# Altium project QAM16.PrjPcb (part 1 of 3)
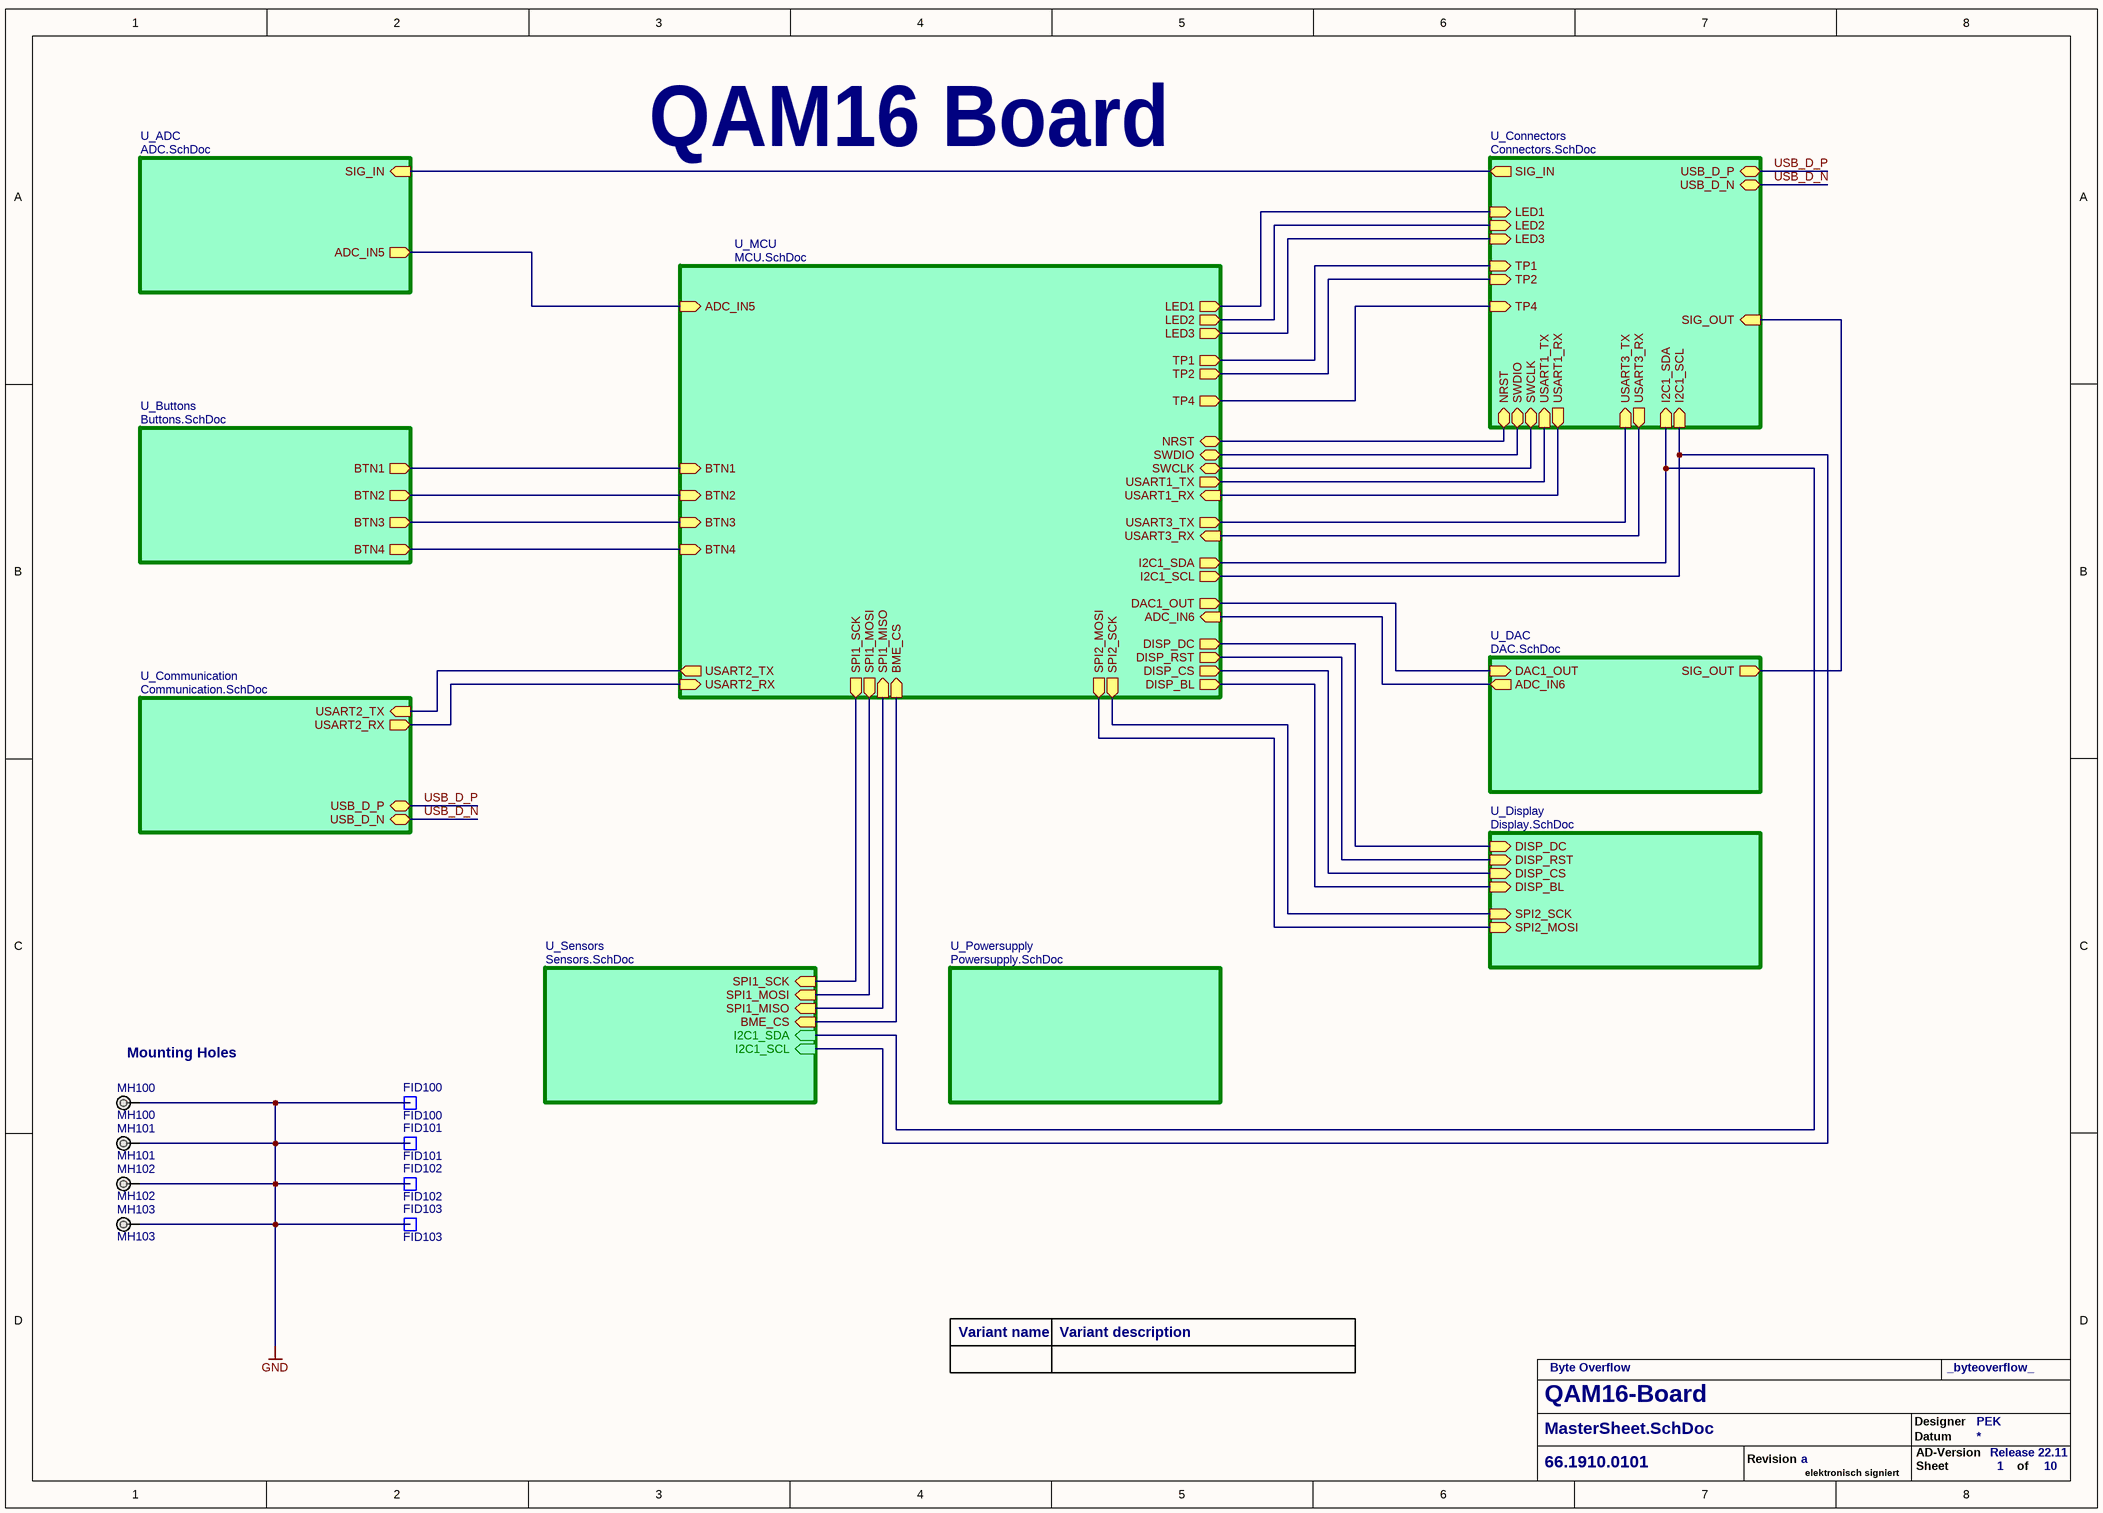
[diagram p0: MasterSheet.SchDoc]
Altium_Version: Release 22.11; PCB_Controll: electronic; PCB_Copper_Thickness: 35um; PCB_Data: Gerber; PCB_Designer: PEK; PCB_Layer_Count: 4; PCB_Material: FR-4 / UL94V-0; PCB_Nummer: 66.1910.0101; PCB_Silkscreen: Top; PCB_Solder_Surface: chem.NiAu - partial; PCB_Surface: black; PCB_Thickness: 1.60 mm; Project_Name: QAM16-Board; Revision_V: a; Schematic_Designer: PEK; Stencil_Thickness: 0.125mm
10 sheets, 209 parts. Net scope: hierarchical (ports join the sheet entries above them; power ports are global).
Board file: QAM16_PCB.PcbDoc
Sheets:
  MasterSheet.SchDoc
    U_ADC = ADC.SchDoc
    U_Buttons = Buttons.SchDoc
    U_Communication = Communication.SchDoc
    U_Connectors = Connectors.SchDoc
    U_DAC = DAC.SchDoc
    U_Display = Display.SchDoc
    U_Sensors = Sensors.SchDoc
    U_MCU = MCU.SchDoc
    U_Powersupply = Powersupply.SchDoc

## Sheet MasterSheet.SchDoc
size A3; Organization: Rotronic AG; Address1: Grindelstrasse 6; Address2: 8303 Bassersdorf; Address3: Switzerland; DocumentNumber: 1; SheetNumber: 1; SheetTotal: 10; Web_Address: www.rotronic.ch; E_Mail_Address: *@rotronic.ch; Fon: +41 (0)44 838 11 11; Fax: +41 (0)44 836 44 24

### Parts
FID100  FID100  [FIDUCIAL_2]
FID101  FID101  [FIDUCIAL_2]
FID102  FID102  [FIDUCIAL_2]
FID103  FID103  [FIDUCIAL_2]
MH100  MH100  [MH_M3_RND_2]  (no BOM)
MH101  MH101  [MH_M3_RND_2]  (no BOM)
MH102  MH102  [MH_M3_RND_2]  (no BOM)
MH103  MH103  [MH_M3_RND_2]  (no BOM)

### Sub-sheets
U_ADC = ADC.SchDoc: ADC_IN5 (out), SIG_IN (in)
U_Buttons = Buttons.SchDoc: BTN1 (out), BTN2 (out), BTN3 (out), BTN4 (out)
U_Communication = Communication.SchDoc: USB_D_N (bidir), USB_D_P (bidir), USART2_RX (out), USART2_TX (in)
U_Connectors = Connectors.SchDoc: NRST (bidir), USB_D_N (bidir), USB_D_P (bidir), USART1_RX (out), USART1_TX (in), SWCLK (bidir), SWDIO (bidir), LED1 (in), LED2 (in), LED3 (in), USART3_RX (out), USART3_TX (in), I2C1_SDA (in), I2C1_SCL (in), SIG_IN (out), SIG_OUT (in), TP4 (in), TP2 (in), TP1 (in)
U_DAC = DAC.SchDoc: DAC1_OUT (in), SIG_OUT (out), ADC_IN6 (out)
U_Display = Display.SchDoc: DISP_DC (in), DISP_RST (in), DISP_CS (in), SPI2_SCK (in), SPI2_MOSI (in), DISP_BL (in)
U_MCU = MCU.SchDoc: SWCLK (bidir), SWDIO (bidir), NRST (bidir), SPI1_SCK (out), SPI1_MOSI (out), SPI1_MISO (in), USART1_RX (in), BTN2 (in), BTN1 (in), USART3_RX (in), USART3_TX (out), TP2 (out), TP1 (out), BME_CS (in), USART2_RX (in), ADC_IN6 (in), ADC_IN5 (in), BTN4 (in), BTN3 (in), USART2_TX (out), DAC1_OUT (out), DISP_DC (out), DISP_RST (out), DISP_CS (out), DISP_BL (out), SPI2_SCK (out), SPI2_MOSI (out), I2C1_SDA (out), I2C1_SCL (out), USART1_TX (out), TP4 (out), LED1 (out), LED2 (out), LED3 (out)
U_Powersupply = Powersupply.SchDoc: no entries
U_Sensors = Sensors.SchDoc: SPI1_SCK (in), SPI1_MOSI (in), SPI1_MISO (in), BME_CS (in), I2C1_SDA (in), I2C1_SCL (in)

### Nets
GND: FID100.1 FID101.1 FID102.1 FID103.1 MH100.1 MH101.1 MH102.1 MH103.1
ADC_IN5: sheet U_ADC/ADC_IN5, sheet U_MCU/ADC_IN5
ADC_IN6: sheet U_DAC/ADC_IN6, sheet U_MCU/ADC_IN6
BME_CS: sheet U_Sensors/BME_CS, sheet U_MCU/BME_CS
BTN1: sheet U_Buttons/BTN1, sheet U_MCU/BTN1
BTN2: sheet U_Buttons/BTN2, sheet U_MCU/BTN2
BTN3: sheet U_Buttons/BTN3, sheet U_MCU/BTN3
BTN4: sheet U_Buttons/BTN4, sheet U_MCU/BTN4
DAC1_OUT: sheet U_DAC/DAC1_OUT, sheet U_MCU/DAC1_OUT
DISP_BL: sheet U_Display/DISP_BL, sheet U_MCU/DISP_BL
DISP_CS: sheet U_Display/DISP_CS, sheet U_MCU/DISP_CS
DISP_DC: sheet U_Display/DISP_DC, sheet U_MCU/DISP_DC
DISP_RST: sheet U_Display/DISP_RST, sheet U_MCU/DISP_RST
I2C1_SCL: sheet U_Connectors/I2C1_SCL, sheet U_Sensors/I2C1_SCL, sheet U_MCU/I2C1_SCL
I2C1_SDA: sheet U_Connectors/I2C1_SDA, sheet U_Sensors/I2C1_SDA, sheet U_MCU/I2C1_SDA
LED1: sheet U_Connectors/LED1, sheet U_MCU/LED1
LED2: sheet U_Connectors/LED2, sheet U_MCU/LED2
LED3: sheet U_Connectors/LED3, sheet U_MCU/LED3
NRST: sheet U_Connectors/NRST, sheet U_MCU/NRST
SIG_IN: sheet U_ADC/SIG_IN, sheet U_Connectors/SIG_IN
SIG_OUT: sheet U_Connectors/SIG_OUT, sheet U_DAC/SIG_OUT
SPI1_MISO: sheet U_Sensors/SPI1_MISO, sheet U_MCU/SPI1_MISO
SPI1_MOSI: sheet U_Sensors/SPI1_MOSI, sheet U_MCU/SPI1_MOSI
SPI1_SCK: sheet U_Sensors/SPI1_SCK, sheet U_MCU/SPI1_SCK
SPI2_MOSI: sheet U_Display/SPI2_MOSI, sheet U_MCU/SPI2_MOSI
SPI2_SCK: sheet U_Display/SPI2_SCK, sheet U_MCU/SPI2_SCK
SWCLK: sheet U_Connectors/SWCLK, sheet U_MCU/SWCLK
SWDIO: sheet U_Connectors/SWDIO, sheet U_MCU/SWDIO
TP1: sheet U_Connectors/TP1, sheet U_MCU/TP1
TP2: sheet U_Connectors/TP2, sheet U_MCU/TP2
TP4: sheet U_Connectors/TP4, sheet U_MCU/TP4
USART1_RX: sheet U_Connectors/USART1_RX, sheet U_MCU/USART1_RX
USART1_TX: sheet U_Connectors/USART1_TX, sheet U_MCU/USART1_TX
USART2_RX: sheet U_Communication/USART2_RX, sheet U_MCU/USART2_RX
USART2_TX: sheet U_Communication/USART2_TX, sheet U_MCU/USART2_TX
USART3_RX: sheet U_Connectors/USART3_RX, sheet U_MCU/USART3_RX
USART3_TX: sheet U_Connectors/USART3_TX, sheet U_MCU/USART3_TX
USB_D_N: sheet U_Communication/USB_D_N, sheet U_Connectors/USB_D_N
USB_D_P: sheet U_Communication/USB_D_P, sheet U_Connectors/USB_D_P

### Notes on the sheet
- QAM16 Board
- (near MH100) Mounting Holes
- Variant name
- Variant description
- Byte Overflow
- _byteoverflow_
- Revision
- Designer
- Datum
- AD-Version
- elektronisch signiert
- Sheet
- of

### Library data of the parts
FID100-FID103 = C0039: FIDUCIAL; Part-Number: 00.0000.0000; Designator: FIDUCIAL-2; ID: C0039; Operating Range: -50°C to +130°C; Specification: 19.09.2011 MLP; Value: FIDUCIAL-2; Component Type: Standard; Status: Active; Availability Date: -; RoHS compliant: Yes; Flammability: UL 94 V-0; Note: FIDUCIAL-2; Price Date: 07.10.2011 MLP; Price 100: 0; Price 1000: 0; Pin Count: 1; Changed: 19.09.2011 MLP; Price: 0
MH100-MH103 = C0025: PCB hole; Part-Number: 00.0000.0000; ID: C0025; Operating Range: -50°C to +130°C; Specification: 15.01.2013 OPT; Value: MH_M3_RND_2; Designator: MH_M3_RND_2; Component Type: Standard; Status: Active; Availability Date: -; Note: MH_M3_RND_2; Price Date: 15.01.2013 OPT; Price 100: 0; Price 1000: 0; Pin Count: 1; Changed: 15.01.2013 OPT; Price: 0.000

## Sheet ADC.SchDoc
size A4; Organization: Rotronic AG; Address1: Grindelstrasse 6; Address2: 8303 Bassersdorf; Address3: Switzerland; DocumentNumber: 9; SheetNumber: 9; SheetTotal: 10; Web_Address: www.rotronic.ch; E_Mail_Address: *@rotronic.ch; Fon: +41 (0)44 838 11 11; Fax: +41 (0)44 836 44 24
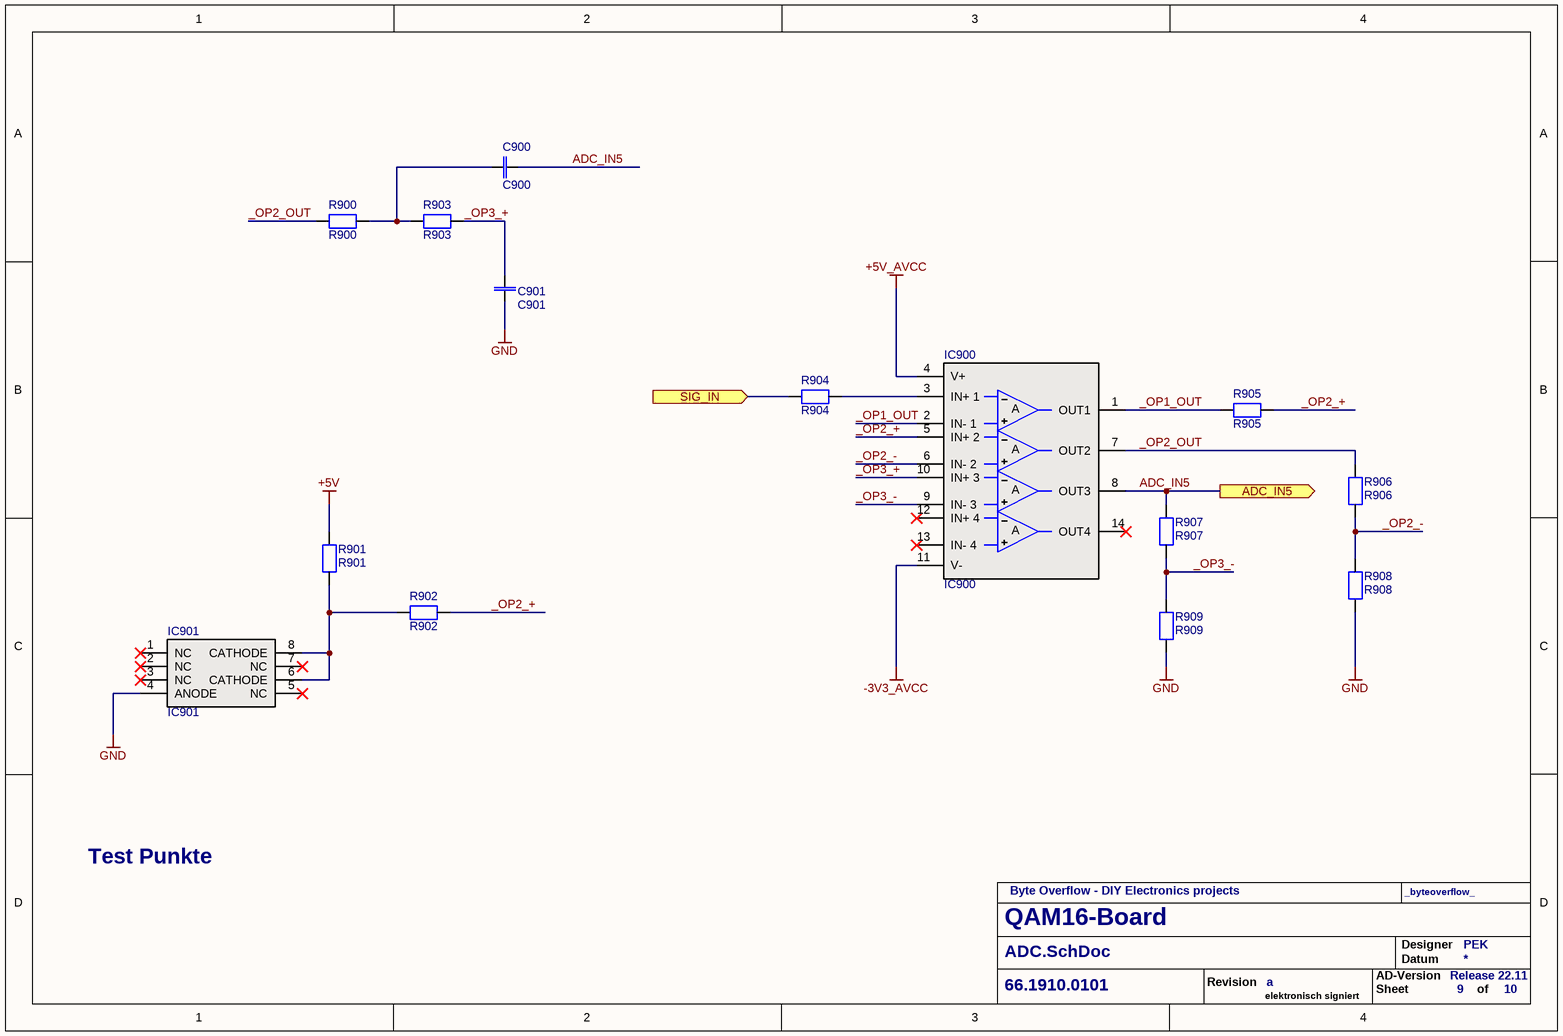
[diagram p1: ADC.SchDoc]

### Parts
C900  C900  [0603-1608]
C901  C901  [0603-1608]
IC900  IC900  [SOIC-14]
IC901  IC901  [MO-153AA]
R900  R900  [0603-1608]
R901  R901  [0805-2012]
R902  R902  [0603-1608]
R903  R903  [0603-1608]
R904  R904  [0603-1608]
R905  R905  [0603-1608]
R906  R906  [0603-1608]
R907  R907  [0603-1608]
R908  R908  [0603-1608]
R909  R909  [0603-1608]

### Ports
ADC_IN5 (out), SIG_IN (in)

### Nets
+5V: R901.1
+5V_AVCC: IC900.4(V+)
-3V3_AVCC: IC900.11(V-)
GND: C901.1 IC901.4(ANODE) R908.1 R909.1
_OP1_OUT: IC900.1(OUT1) IC900.2(IN-_1) R905.1
_OP2_+: IC900.5(IN+_2) R902.2 R905.2
_OP2_-: IC900.6(IN-_2) R906.2 R908.2
_OP2_OUT: IC900.7(OUT2) R900.1 R906.1
_OP3_+: C901.2 IC900.10(IN+_3) R903.2
_OP3_-: IC900.9(IN-_3) R907.2 R909.2
ADC_IN5: C900.2 IC900.8(OUT3) R907.1 ; port ADC_IN5
SIG_IN: R904.1 ; port SIG_IN
NetC900_1: C900.1 R900.2 R903.1
NetIC900_3: IC900.3(IN+_1) R904.2
NetIC901_6: IC901.6(CATHODE) IC901.8(CATHODE) R901.2 R902.1

Not connected (* = marked no-connect by the designer): IC900 12(IN+_4)* 13(IN-_4)* 14(OUT4)*; IC901 1(NC)* 2(NC)* 3(NC)* 5(NC)* 7(NC)*

### Notes on the sheet
- Test Punkte
- Byte Overflow - DIY Electronics projects
- _byteoverflow_
- Revision
- AD-Version
- Designer
- Datum
- elektronisch signiert
- Sheet
- of
- (in symbol I0016) A

### Library data of the parts
C900 C901 = F0058: Capacitor; Part-Number: 63.0224.1400; Manufacturer: KEMET; Manufacturer Part Number: C0603C224K4RAC7867; Designator: C 220nF 16V; ID: F0058; Operating Range: -55°C to +85°C; Note: 220nF X5R 16V 10% Taiyo Yuden EMK107BJ224KAHT; Specification: 19.09.2011 MLP; Verification: 05.07.2012 OPT; Value: 220nF 16V; Component Type: Standard; ComponentLink1Description: http://www.kemet.com/docfinder?Partnumber=C0603C224K4RACTU; ComponentLink1URL: http://www.kemet.com/docfinder?Partnumber=C0603C224K4RACTU; Status: Active; Availability Date: 15.11.2016 OPT; RoHS compliant: Yes; Flammability: n.a.; Pin Count: 2; Price 100: 0.02; Price 1000: 0.02; Price Date: 02.12.2019 Pro Alpha; Changed: 19.09.2011 MLP; Price: 0.02; Supplier 1: Digi-Key; Supplier Part Number 1: 399-5619-1-ND; Part Status: Active; RoHS: RoHS Compliant
IC900 = I0016: OPAMP; Part-Number: 00.0000.0000; Manufacturer: Texas Instruments; Designator: LMC6484IMX/NOPB; ID: I0016; Operating Range: -40°C to +125°C; Note: Operationsverstärker CMOS QUAD Rail to Rail; Changed: 19.09.2020 PEK; Value: LMC6484IMX/NOPB; Component Type: Standard; ComponentLink1Description: Datasheet; ComponentLink1URL: https://www.ti.com/lit/ds/symlink/lmc6484.pdf?ts=1600470487572&ref_url=https%253A%252F%252Fwww.ti.com%252Fstore%252Fti%252Fen%252Fp%252Fproduct%252F%253Fp%253DLMC6484IMX%252FNOPB; Status: Active; Availability Date: 19.09.2020 PEK; RoHS compliant: Yes; Flammability: n.a.; Pin Count: 14; Price 100: 1.52; Price 1000: 1.03; Price Date: 19.09.2020 PEK; Specification: 19.09.2020 PEK; Price: 2.25; Supplier 1: Mouser; Supplier Part Number 1: LMC6484IMX/NOPB; Manufacturer Part Number: LMC6484IMX/NOPB; Part Status: Active; RoHS: RoHS Compliant
IC901 = E0101: Voltage reference; Part-Number: 00.0000.0000; Manufacturer: Texas Instruments; Designator: LT1004IPWR-1-2; ID: E0101; Operating Range: -55°C to +85°C; Note: Ti LT1004IPWR-1-2 1.235V MICROPOWER INTEGRATED VOLTAGE REFERENCE; Specification: 28.10.2015 OPT; Value: LT1004IPWR-1-2; Component Type: Standard; ComponentLink1Description: Datasheet; ComponentLink1URL: http://www.ti.com/lit/ds/symlink/lt1004-1.2.pdf; Status: Active; Availability Date: 15.11.2016 OPT; RoHS compliant: Yes; Flammability: n.a.; Pin Count: 8; Price 100: 0.587; Price 1000: 0.409; Price Date: 28.10.2015 OPT; Changed: 28.10.2015 OPT; Price: 0.946; Supplier 1: Digi-Key; Supplier Part Number 1: 296-13079-1-ND; Manufacturer Part Number: LT1004IPWR-1-2; Part Status: Active; RoHS: RoHS Compliant
R900 R902-R905 R908 R909 = Q0017: Resistor; Part-Number: 71.1002.1300; Manufacturer: Vishay Dale; Manufacturer Part Number: CRCW060310K0FKEAHP; Designator: R 10k 1%; ID: Q0017; Operating Range: -55°C to +155°C; Note: 10k 1% 100ppm 1/10W Vishay CRCW060310K0FKEA; Changed: 19.09.2011 MLP; Verification: 05.07.2012 OPT; Value: 10k; Component Type: Standard; ComponentLink1Description: http://www.vishay.com/docs/20043/crcwhpe3.pdf; ComponentLink1URL: http://www.vishay.com/docs/20043/crcwhpe3.pdf; Status: Active; Availability Date: 16.11.2016 OPT; RoHS compliant: Yes; Flammability: n.a.; Pin Count: 2; Price 100: 0.002; Price 1000: 0.002; Price Date: 02.12.2019 Pro Alpha; Specification: 19.09.2011 MLP; Price: 0.001; Supplier: Digi-Key; Supplier Part Number: 541-10.0KSCT-ND; Part Status: Active; RoHS: RoHS Compliant
R901 = Q0328: Resistor; Part-Number: 71.1003.1700; Manufacturer: Vishay Dale; Manufacturer Part Number: CRCW0805100KFKEA; Designator: R 100k 1.0%; ID: Q0328; Operating Range: -55°C to +155°C; Note: 100k 1.0% 100ppm 1/8W Vishay CRCW0805100KFKEA; Changed: 28.07.2015 OPT; Value: 100k 1.0%; Component Type: Standard; ComponentLink1Description: Datasheet; ComponentLink1URL: http://www.vishay.com/docs/20035/dcrcwe3.pdf; Status: Active; Availability Date: 16.11.2016 OPT; RoHS compliant: Yes; Flammability: n.a.; Pin Count: 2; Price 100: 0.026; Price 1000: 0.018; Price Date: 02.12.2019 Pro Alpha; Specification: 28.07.2015 OPT; Price: 0.009; Supplier: Digi-Key; Supplier Part Number: 541-100KCCT-ND; Part Status: Active; RoHS: RoHS Compliant
R906 R907 = Q0180: Resistor; Part-Number: 71.6801.1300; Manufacturer: Vishay Dale; Manufacturer Part Number: CRCW06036K80FKEA; Designator: R 6.8k 1%; ID: Q0180; Operating Range: -55°C to +155°C; Note: 6.8k 1% 100ppm 1/10W Vishay CRCW06036K80FKEA; Changed: 19.09.2011 MLP; Verification: 05.07.2012 OPT; Value: 6.8k 1%; Component Type: Standard; ComponentLink1Description: http://www.vishay.com/docs/20035/dcrcwe3.pdf; ComponentLink1URL: http://www.vishay.com/docs/20035/dcrcwe3.pdf; Status: Active; Availability Date: 16.11.2016 OPT; RoHS compliant: Yes; Flammability: n.a.; Pin Count: 2; Price 100: 0.002; Price 1000: 0.002; Price Date: 02.12.2019 Pro Alpha; Specification: 19.09.2011 MLP; Price: 0.002; Supplier: Digi-Key; Supplier Part Number: 541-6.80KHCT-ND; Part Status: Active; RoHS: RoHS Compliant

## Sheet Buttons.SchDoc
size A4; Organization: Rotronic AG; Address1: Grindelstrasse 6; Address2: 8303 Bassersdorf; Address3: Switzerland; DocumentNumber: 3; SheetNumber: 3; SheetTotal: 10; Web_Address: www.rotronic.ch; E_Mail_Address: *@rotronic.ch; Fon: +41 (0)44 838 11 11; Fax: +41 (0)44 836 44 24
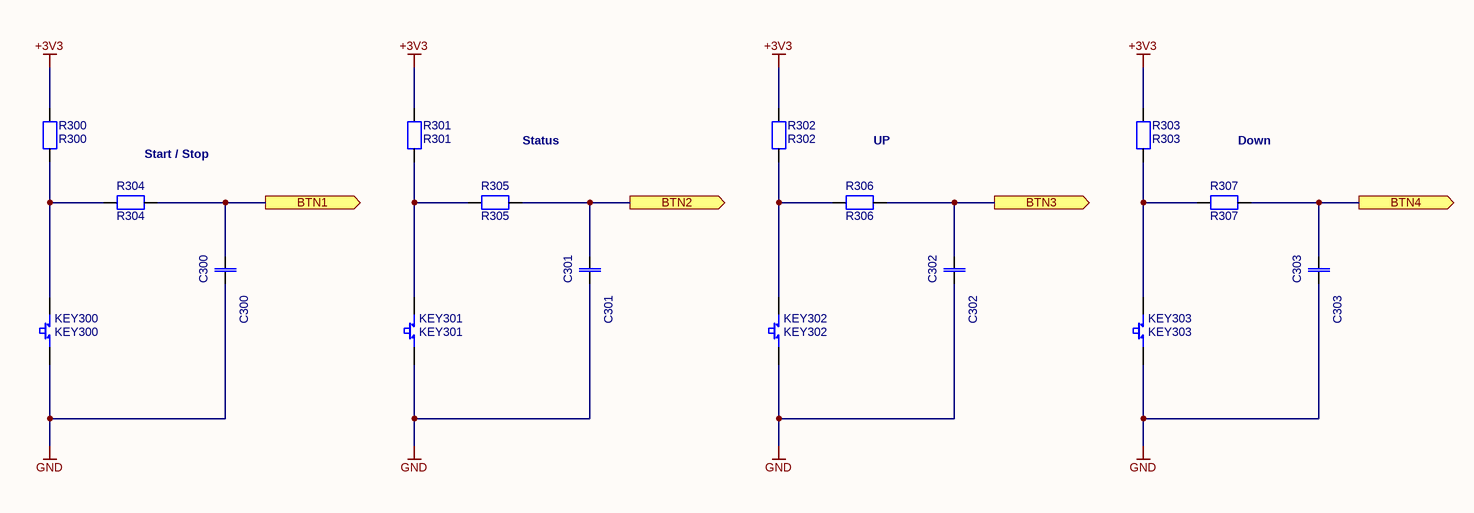
[diagram p2: Buttons.SchDoc]

### Parts
C300  C300  [0603-1608]
C301  C301  [0603-1608]
C302  C302  [0603-1608]
C303  C303  [0603-1608]
KEY300  KEY300  [SW_TL9210AF180Q]
KEY301  KEY301  [SW_TL9210AF180Q]
KEY302  KEY302  [SW_TL9210AF180Q]
KEY303  KEY303  [SW_TL9210AF180Q]
R300  R300  [0603-1608]
R301  R301  [0603-1608]
R302  R302  [0603-1608]
R303  R303  [0603-1608]
R304  R304  [0603-1608]
R305  R305  [0603-1608]
R306  R306  [0603-1608]
R307  R307  [0603-1608]

### Ports
BTN1 (out), BTN2 (out), BTN3 (out), BTN4 (out)

### Nets
+3V3: R300.1 R301.1 R302.1 R303.1
GND: C300.2 C301.2 C302.2 C303.2 KEY300.1 KEY301.1 KEY302.1 KEY303.1
BTN1: C300.1 R304.2 ; port BTN1
BTN2: C301.1 R305.2 ; port BTN2
BTN3: C302.1 R306.2 ; port BTN3
BTN4: C303.1 R307.2 ; port BTN4
NetKEY300_2: KEY300.2 R300.2 R304.1
NetKEY301_2: KEY301.2 R301.2 R305.1
NetKEY302_2: KEY302.2 R302.2 R306.1
NetKEY303_2: KEY303.2 R303.2 R307.1

### Notes on the sheet
- (near R304) Start / Stop
- Status
- UP
- Down
- Byte Overflow - DIY Electronics projects
- mootseeker98@gmail.com
- Revision
- AD-Version
- Designer
- Datum
- elektronisch signiert
- Sheet
- of

### Library data of the parts
C300-C303 = F0161: Capacitor; Part-Number: 63.0104.1450; Manufacturer: KEMET; Manufacturer Part Number: C0603C104K5RACTU; Designator: C 100nF 50V X7R; ID: F0161; Operating Range: -55°C to +125°C; Note: 100nF 50V X7R 10% Kemet C0603C104K5RACTU; Specification: 05.09.2013 OPT; Value: 100nF 50V; Component Type: Standard; ComponentLink1Description: Datasheet; ComponentLink1URL: http://www.kemet.com/kemet/web/homepage/kechome.nsf/vapubfiles/KEM_C1002_X7R_SMD.pdf/$file/KEM_C1002_X7R_SMD.pdf; Status: Active; Availability Date: 15.11.2016 OPT; RoHS compliant: Yes; Flammability: n.a.; Pin Count: 2; Price 100: 0.007; Price 1000: 0.007; Price Date: 02.12.2019 Pro Alpha; Changed: 05.09.2013 OPT; Price: 0.01; Supplier 1: Digi-Key; Supplier Part Number 1: 399-5089-1-ND; Part Status: Active; RoHS: RoHS Compliant
KEY300-KEY303 = O0015: Button; Part-Number: 00.0000.0000; Manufacturer: E-Switch; ID: O0015; Operating Range: -20°C to +60°C; Note: Sensorschalter 180gF SPST LngTravel 50mA 12VDC 200gF; Specification: 05.11.2022 PEK; Value: TL9210AF180Q; Component Type: Standard; ComponentLink1Description: Datasheet; ComponentLink1URL: https://www.mouser.ch/datasheet/2/140/e-switch_TL9210-1165861.pdf; Status: Active; Availability Date: 05.11.2022 PEK; RoHS compliant: Yes; Flammability: n.a.; Pin Count: 2; Price 100: 0.61; Price 1000: 0.38; Price Date: 05.11.2022 PEK; Changed: 05.11.2022 PEK; Price: 0.63; Supplier 1: Mouser; Supplier Part Number 1: 612-TL9210AF180Q; Manufacturer Part Number: TL9210AF180Q; Part Status: Active; RoHS: RoHS Compliant; Designator: TL9210AF180Q
R300-R303 = Q0017: as R900 on sheet ADC; Component Type: Standard; ComponentLink1Description: http://www.vishay.com/docs/20043/crcwhpe3.pdf; ComponentLink1URL: http://www.vishay.com/docs/20043/crcwhpe3.pdf; Status: Active; Availability Date: 16.11.2016 OPT; RoHS compliant: Yes; Flammability: n.a.; Pin Count: 2; Price 100: 0.002; Price 1000: 0.002; Price Date: 02.12.2019 Pro Alpha; Specification: 19.09.2011 MLP; Price: 0.001; Supplier: Digi-Key; Supplier Part Number: 541-10.0KSCT-ND; Part Status: Active; RoHS: RoHS Compliant
R304-R307 = Q0011: Resistor; Part-Number: 71.1000.1300; Manufacturer: Vishay Dale; Manufacturer Part Number: CRCW0603100RFKEA; Designator: R 100E 1%; ID: Q0011; Operating Range: -55°C to +155°C; Note: 100E 1% 100ppm 1/10W Vishay / Dale CRCW0603100RFKTB; Changed: 19.09.2011 MLP; Verification: 05.07.2012 OPT; Value: 100E 1%; Component Type: Standard; ComponentLink1Description: http://www.vishay.com/docs/20035/dcrcwe3.pdf; ComponentLink1URL: http://www.vishay.com/docs/20035/dcrcwe3.pdf; Status: Active; Availability Date: 16.11.2016 OPT; RoHS compliant: Yes; Flammability: n.a.; Pin Count: 2; Price 100: 0.002; Price 1000: 0.002; Price Date: 02.12.2019 Pro Alpha; Specification: 19.09.2011 MLP; Price: 0.002; Supplier: Digi-Key; Supplier Part Number: 541-100HCT-ND; Part Status: Active; RoHS: RoHS Compliant

## Sheet Communication.SchDoc
size A4; Organization: Rotronic AG; Address1: Grindelstrasse 6; Address2: 8303 Bassersdorf; Address3: Switzerland; DocumentNumber: 6; SheetNumber: 6; SheetTotal: 10; Web_Address: www.rotronic.ch; E_Mail_Address: *@rotronic.ch; Fon: +41 (0)44 838 11 11; Fax: +41 (0)44 836 44 24
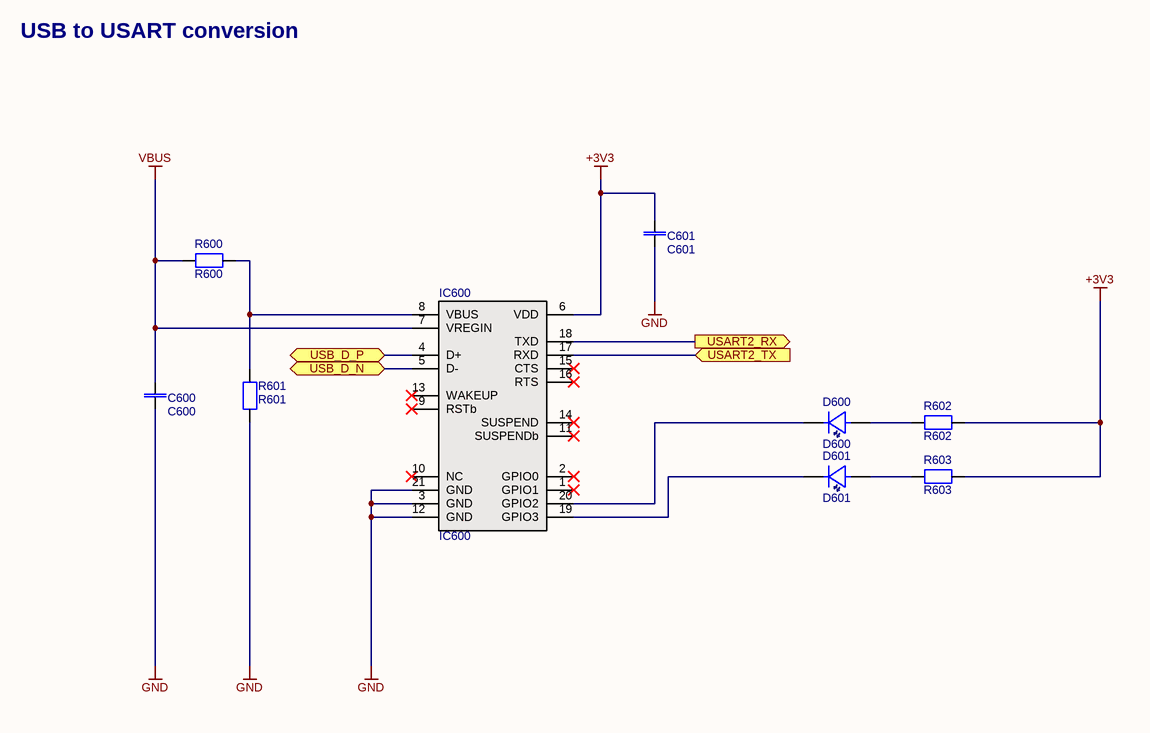
[diagram p3: Communication.SchDoc]

### Parts
C600  C600  [0805-2012]
C601  C601  [0805-2012]
D600  D600  [0805_LED]
D601  D601  [0805_LED]
IC600  IC600  [GQFN20R]
R600  R600  [0603-1608]
R601  R601  [0603-1608]
R602  R602  [0805-2012]
R603  R603  [0805-2012]

### Ports
USART2_RX (out), USART2_TX (in), USB_D_N (bidir), USB_D_P (bidir)

### Nets
+3V3: C601.1 IC600.6(VDD) R602.2 R603.2
GND: C600.2 C601.2 IC600.3(GND) IC600.12(GND) IC600.21(GND) R601.2
VBUS: C600.1 IC600.7(VREGIN) R600.1
USART2_RX: IC600.18(TXD) ; port USART2_RX
USART2_TX: IC600.17(RXD) ; port USART2_TX
USB_D_N: IC600.5(D-) ; port USB_D_N
USB_D_P: IC600.4(D+) ; port USB_D_P
NetD600_1: D600.1(A) R602.1
NetD600_2: D600.2(K) IC600.20(GPIO2)
NetD601_1: D601.1(A) R603.1
NetD601_2: D601.2(K) IC600.19(GPIO3)
NetIC600_8: IC600.8(VBUS) R600.2 R601.1

Not connected (* = marked no-connect by the designer): IC600 1(GPIO1)* 2(GPIO0)* 9(RSTb)* 10(NC)* 11(SUSPENDb)* 13(WAKEUP)* 14(SUSPEND)* 15(CTS)* 16(RTS)*

### Notes on the sheet
- USB to USART conversion
- Byte Overflow - DIY Electronics projects
- _byteoverflow_
- Revision
- AD-Version
- Designer
- Datum
- elektronisch signiert
- Sheet
- of

### Library data of the parts
C600 C601 = F0127: Capacitor; Part-Number: 63.0105.1500; Manufacturer: Murata Electronics North America; Manufacturer Part Number: GRM21BF51H105ZA12L; Designator: C 1uF 50V; ID: F0127; Operating Range: -30°C to +85°C; Note: 1uF 50V Y5V 20% Murata GRM21BF51H105ZA12L; Specification: 27.12.2012 OPT; Value: 1uF 50V; Component Type: Standard; ComponentLink1Description: Datasheet; ComponentLink1URL: http://www.murata.com/products/catalog/pdf/c02e.pdf; Status: Active; Availability Date: 15.11.2016 OPT; RoHS compliant: Yes; Flammability: n.a.; ComponentLink2Description: http://search.murata.co.jp/Ceramy/image/img/A01X/G101/ENG/GRM21BF51H105ZA12-01.pdf; ComponentLink2URL: http://search.murata.co.jp/Ceramy/image/img/A01X/G101/ENG/GRM21BF51H105ZA12-01.pdf; Pin Count: 2; Price 100: 0.067; Price 1000: 0.067; Price Date: 02.12.2019 Pro Alpha; Changed: 27.12.2012 OPT; Price: 0.118; Supplier 1: Digi-Key; Supplier Part Number 1: 490-3903-1-ND; Part Status: Discontinued at Digi-Key; RoHS: RoHS Compliant
D600 D601 = A0053: LED; Part-Number: 00.0000.0000; Manufacturer: Dialight; Manufacturer Part Number: 5988170107F; Designator: LED SMD 0805; ID: A0053; Operating Range: -30°C to +85°C; Note: LED SMD 0805 Green Dialight 598-8170-107F; Value: LED SMD 0805; Specification: 27.12.2012 OPT; Verification: 25.01.2013 MLP; Component Type: Standard; ComponentLink1Description: Datasheet; ComponentLink1URL: http://www.dialight.com/Assets/Brochures_And_Catalogs/Indication/598_SelectorGuide.pdf; Status: Active; Availability Date: 14.11.2016 OPT; RoHS compliant: Yes; Flammability: n.a.; Pin Count: 2; Price 100: 0.092; Price 1000: 0.075; Changed: 27.12.2012 OPT; Price: 0.092; Price Date: 17.09.2014 OPT; Supplier: Digi-Key; Supplier Part Number: 350-2044-1-ND; Part Status: Active; RoHS: RoHS Compliant
IC600 = E0130: Interface; Part-Number: 00.0000.0000; Manufacturer: Silicon Labs; Manufacturer Part Number: CP2102N-A02-GQFN20; ID: E0130; Operating Range: -40°C to +85°C; Note: USB-IC-Schnittstelle USB to UART bridge - QFN20; Specification: 02.12.2019 PEK; Value: CP2102N-A02; Designator: CP2102N-A02; Component Type: Standard; ComponentLink1Description: Datasheet; ComponentLink1URL: https://www.mouser.ch/datasheet/2/368/cp2102n-datasheet-1634912.pdf; Status: Active; Availability Date: 02.12.2019 PEK; RoHS compliant: Yes; Flammability: n.a; Pin Count: 21; Price 100: 1.18; Price 1000: 1.14; Price Date: 02.12.2019 PEK; Changed: 02.12.2019 PEK; Price: 1.27; Supplier 1: Mouser; Supplier Part Number 1: CP2102N-A02-GQFN20; Part Status: Active; RoHS: RoHS Compliant
R600 = Q0094: Resistor; Part-Number: 71.2202.1300; Manufacturer: Vishay Dale; Manufacturer Part Number: CRCW060322K0FKEA; ID: Q0094; Operating Range: -55°C to +155°C; Note: 22k 1% 100ppm 1/10W Vishay CRCW060322K0FKTA; Changed: 19.09.2011 MLP; Value: 22k 1%; Verification: 05.07.2012 OPT; Designator: R 22k 1%; Component Type: Standard; ComponentLink1Description: http://www.vishay.com/docs/20035/dcrcwe3.pdf; ComponentLink1URL: http://www.vishay.com/docs/20035/dcrcwe3.pdf; Status: Active; Availability Date: 16.11.2016 OPT; RoHS compliant: Yes; Flammability: n.a.; Pin Count: 2; Price 100: 0.002; Price 1000: 0.002; Price Date: 02.12.2019 Pro Alpha; Specification: 19.09.2011 MLP; Price: 0.002; Part Status: Active; RoHS: RoHS Compliant; Supplier: Digi-Key; Supplier Part Number: 541-22.0KHCT-ND
R601 = Q0153: Resistor; Part-Number: 71.4702.1300; Manufacturer: Vishay Dale; Manufacturer Part Number: CRCW060347K0FKEA; ID: Q0153; Note: 47K 1% 100ppm 1/10W CRCW060347K0FKEA; Changed: 19.09.2011 MLP; Value: 47K 1%; Verification: 05.07.2012 OPT; Designator: R 47K 1%; Component Type: Standard; ComponentLink1Description: http://www.vishay.com/docs/20035/dcrcwe3.pdf; ComponentLink1URL: http://www.vishay.com/docs/20035/dcrcwe3.pdf; Operating Range: -; Status: Active; Availability Date: 16.11.2016 OPT; RoHS compliant: Yes; Flammability: n.a.; Pin Count: 2; Price 100: 0.002; Price 1000: 0.002; Price Date: 02.12.2019 Pro Alpha; Specification: 19.09.2011 MLP; Price: 0.002; Supplier: Digi-Key; Supplier Part Number: 541-47.0KHCT-ND; Part Status: Active; RoHS: RoHS Compliant
R602 R603 = Q0422: Resistor; Part-Number: 00.0000.0000; Manufacturer: Panasonic Electronic Components; Manufacturer Part Number: ERJ-6ENF5600V; Designator: R 560E 1%; ID: Q0422; Operating Range: -55°C to +155°C; Note: Dickfilmwiderstände - SMD 0805 560ohms 1% AEC-Q200; Changed: 15.11.2019 PEK; Value: 560E 1%; Component Type: Standard; ComponentLink1Description: Datasheet; ComponentLink1URL: https://www.mouser.ch/datasheet/2/315/AOA0000C304-1149620.pdf; Status: Active; Availability Date: 15.11.2019 PEK; RoHS compliant: Yes; Flammability: n.a.; Pin Count: 2; Price 100: 0.03; Price 1000: 0.011; Price Date: 15.11.2019 PEK; Specification: 15.11.2019 PEK; Price: 0.098; Supplier: Mouser; Supplier Part Number: 667-ERJ-6ENF5600V; Part Status: Active; RoHS: RoHS Compliant

## Sheet Connectors.SchDoc
size A3; Organization: Rotronic AG; Address1: Grindelstrasse 6; Address2: 8303 Bassersdorf; Address3: Switzerland; DocumentNumber: 7; SheetNumber: 7; SheetTotal: 10; Web_Address: www.rotronic.ch; E_Mail_Address: *@rotronic.ch; Fon: +41 (0)44 838 11 11; Fax: +41 (0)44 836 44 24
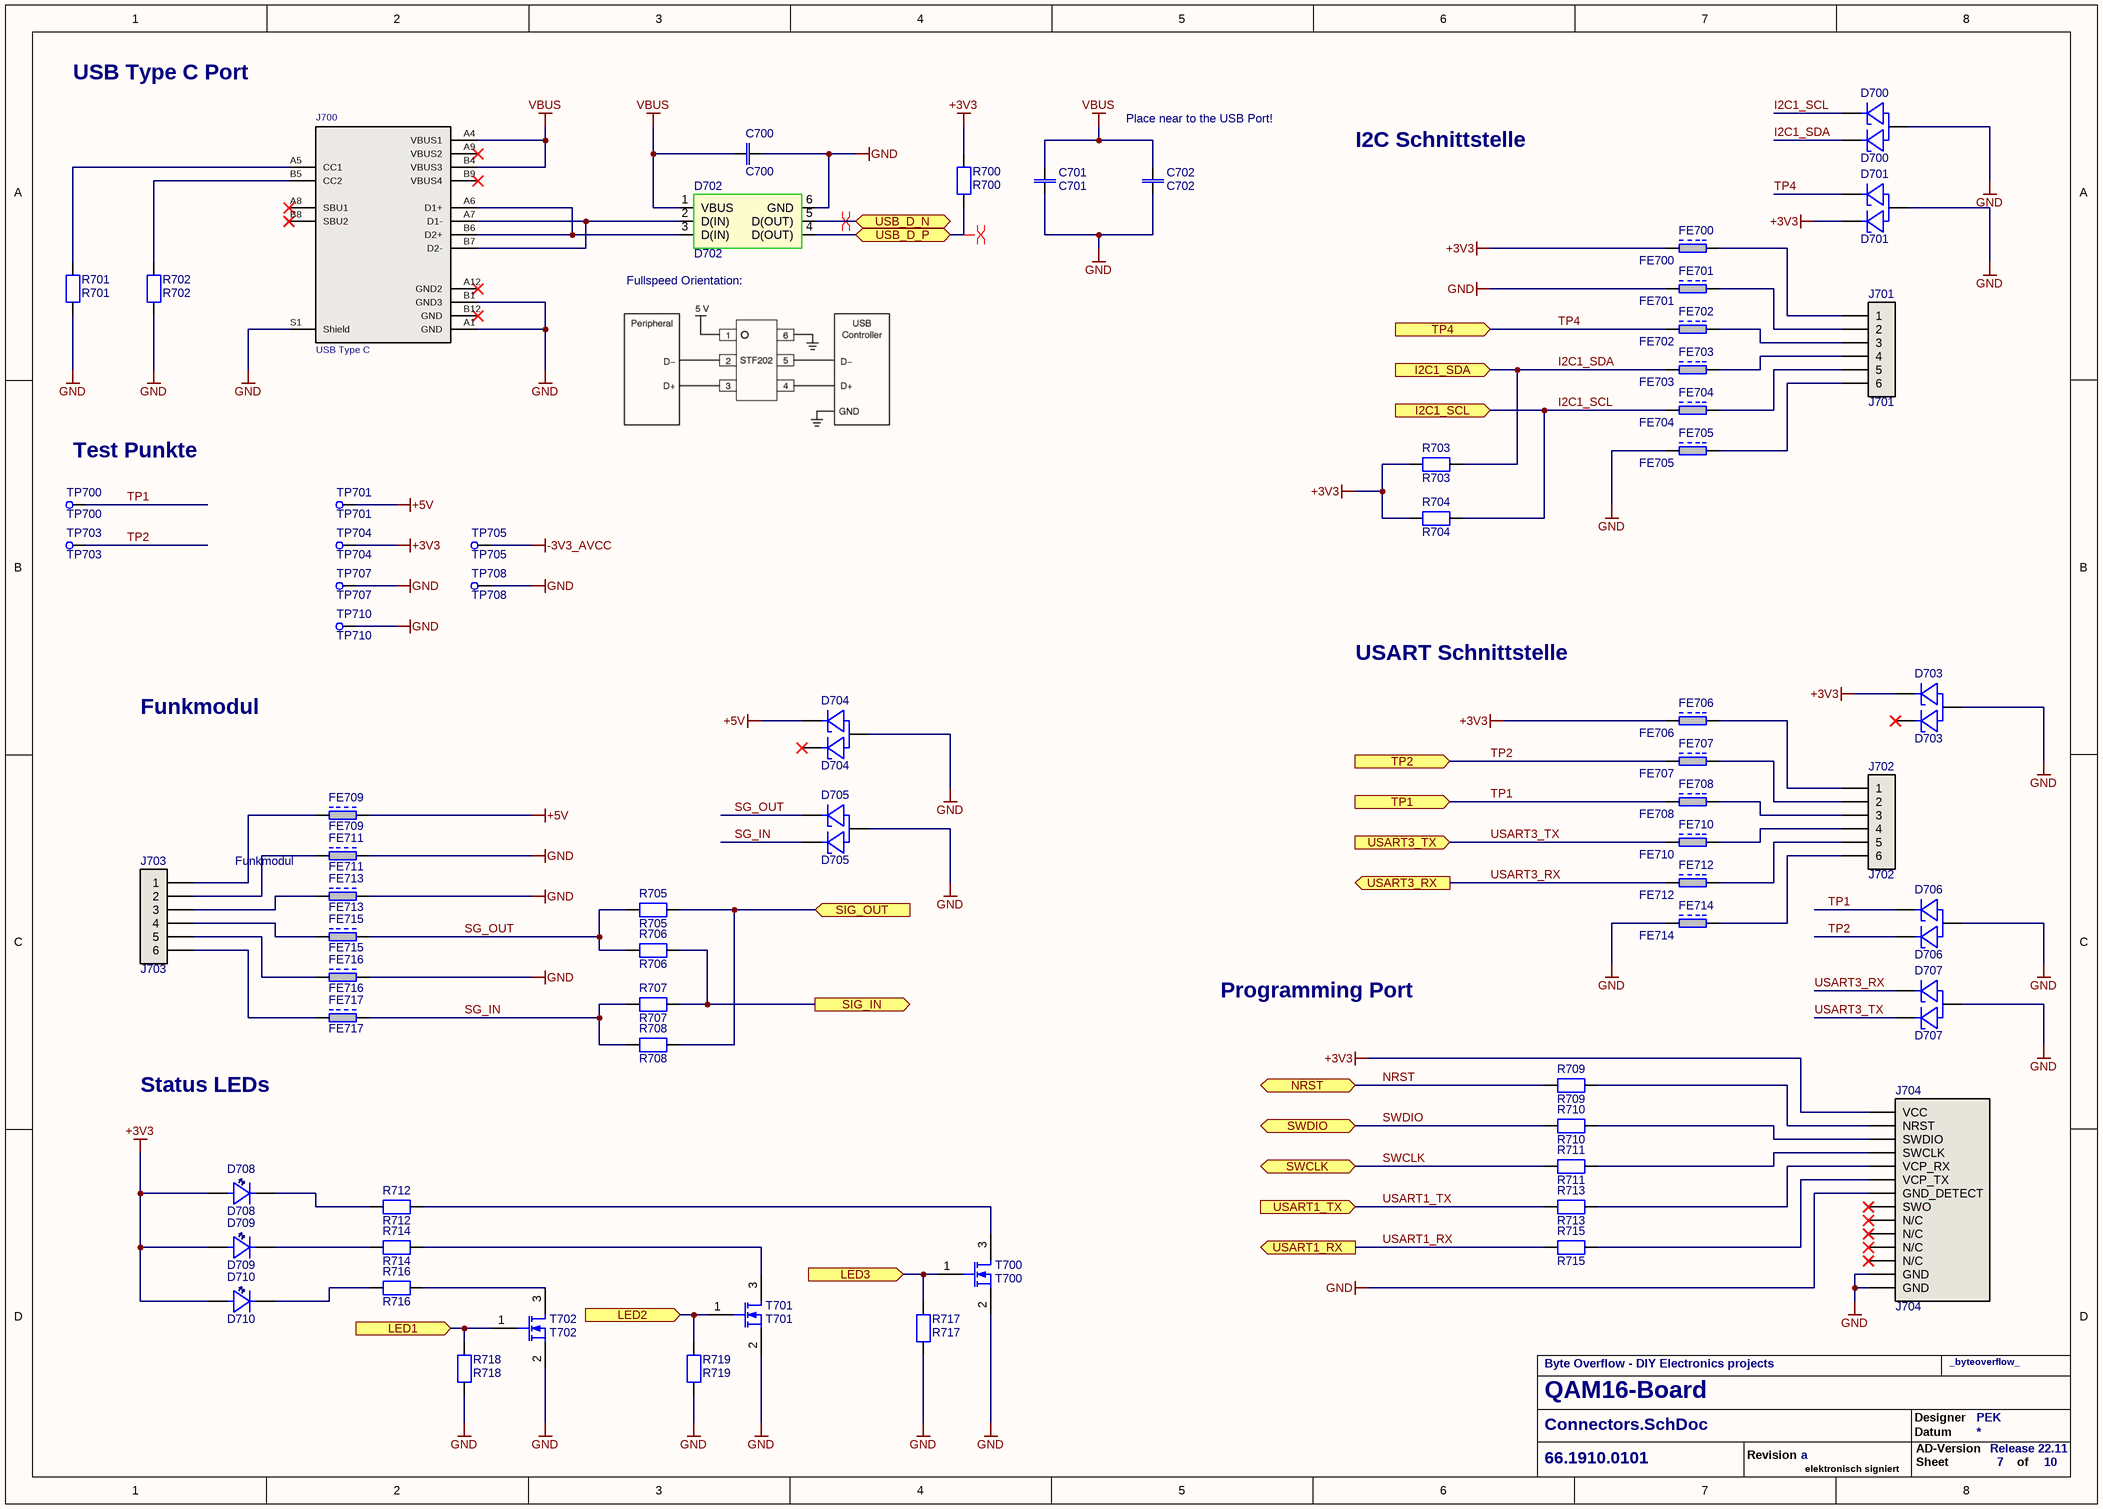
[diagram p4: Connectors.SchDoc]

### Parts
C700  C700  [0805-2012]
C701  C701  [0805-2012]
C702  C702  [0805-2012]
D700  D700  [SOT-23-3]
D701  D701  [SOT-23-3]
D702  D702  [SOT-23-6]
D703  D703  [SOT-23-3]
D704  D704  [SOT-23-3]
D705  D705  [SOT-23-3]
D706  D706  [SOT-23-3]
D707  D707  [SOT-23-3]
D708  D708  [0805_LED]
D709  D709  [0805_LED]
D710  D710  [0805_LED]
FE700  FE700  [0603-1608]
FE701  FE701  [0603-1608]
FE702  FE702  [0603-1608]
FE703  FE703  [0603-1608]
FE704  FE704  [0603-1608]
FE705  FE705  [0603-1608]
FE706  FE706  [0603-1608]
FE707  FE707  [0603-1608]
FE708  FE708  [0603-1608]
FE709  FE709  [0603-1608]
FE710  FE710  [0603-1608]
FE711  FE711  [0603-1608]
FE712  FE712  [0603-1608]
FE713  FE713  [0603-1608]
FE714  FE714  [0603-1608]
FE715  FE715  [0603-1608]
FE716  FE716  [0603-1608]
FE717  FE717  [0603-1608]
J700  USB Type C  [GCT_USB4105]
J701  J701  [Stiftleiste_6pol]
J702  J702  [Stiftleiste_6pol]
J703  J703  [Stiftleiste_6pol]
J704  J704  [SAMTEC_FTSH-107-01-L-DV-K-A]
R700  R700  [0603-1608]
R701  R701  [0603-1608]
R702  R702  [0603-1608]
R703  R703  [0603-1608]
R704  R704  [0603-1608]
R705  R705  [0805-2012]
R706  R706  [0805-2012]
R707  R707  [0805-2012]
R708  R708  [0805-2012]
R709  R709  [0603-1608]
R710  R710  [0603-1608]
R711  R711  [0603-1608]
R712  R712  [0805-2012]
R713  R713  [0603-1608]
R714  R714  [0805-2012]
R715  R715  [0603-1608]
R716  R716  [0805-2012]
R717  R717  [0603-1608]
R718  R718  [0603-1608]
R719  R719  [0603-1608]
T700  T700  [SOT-323]
T701  T701  [SOT-323]
T702  T702  [SOT-323]
TP700  TP700  [Testpoint]
TP701  TP701  [Testpoint]
TP703  TP703  [Testpoint]
TP704  TP704  [Testpoint]
TP705  TP705  [Testpoint]
TP707  TP707  [Testpoint]
TP708  TP708  [Testpoint]
TP710  TP710  [Testpoint]

### Ports
I2C1_SCL (in), I2C1_SDA (in), LED1 (in), LED2 (in), LED3 (in), NRST (bidir), SIG_IN (out), SIG_OUT (in), SWCLK (bidir), SWDIO (bidir), TP1 (in), TP2 (in), TP4 (in), USART1_RX (out), USART1_TX (in), USART3_RX (out), USART3_TX (in), USB_D_N (bidir), USB_D_P (bidir)

### Nets
+3V3: D701.1 D703.2 D708.1(A) D709.1(A) D710.1(A) FE700.1 FE706.1 J704.3(VCC) R700.1 R703.1 R704.1 TP704.1
+5V: D704.2 FE709.1 TP701.1
-3V3_AVCC: TP705.1
GND: C700.2 C701.2 C702.2 D700.3 D701.3 D702.6(GND) D703.3 D704.3 D705.3 D706.3 D707.3 FE701.1 FE705.1 FE711.1 FE713.1 FE714.1 FE716.1 J700.A1(GND) J700.B1(GND3) J700.S1(Shield) J704.5(GND) J704.7(GND) J704.11(GND_DETECT) R701.2 R702.2 R717.2 R718.2 R719.2 T700.2(S) T701.2(S) T702.2(S) TP707.1 TP708.1 TP710.1
VBUS: C700.1 C701.1 C702.1 D702.1(VBUS) J700.A4(VBUS1) J700.B4(VBUS3)
I2C1_SCL: D700.2 FE704.1 R704.2 ; port I2C1_SCL
I2C1_SDA: D700.1 FE703.1 R703.2 ; port I2C1_SDA
LED1: R718.1 T702.1(G) ; port LED1
LED2: R719.1 T701.1(G) ; port LED2
LED3: R717.1 T700.1(G) ; port LED3
NRST: R709.1 ; port NRST
SG_IN: D705.1 FE717.1 R707.1 R708.1
SG_OUT: D705.2 FE715.1 R705.1 R706.1
SIG_IN: R706.2 R707.2 ; port SIG_IN
SIG_OUT: R705.2 R708.2 ; port SIG_OUT
SWCLK: R711.1 ; port SWCLK
SWDIO: R710.1 ; port SWDIO
TP1: D706.2 FE708.1 TP700.1 ; port TP1
TP2: D706.1 FE707.1 TP703.1 ; port TP2
TP4: D701.2 FE702.1 ; port TP4
USART1_RX: R715.1 ; port USART1_RX
USART1_TX: R713.1 ; port USART1_TX
USART3_RX: D707.2 FE712.1 ; port USART3_RX
USART3_TX: D707.1 FE710.1 ; port USART3_TX
USB_D_N: D702.5(D(OUT)) ; port USB_D_N
USB_D_P: D702.4(D(OUT)) R700.2 ; port USB_D_P
NetD702_2: D702.2(D(IN)) J700.A7(D1-) J700.B7(D2-)
NetD702_3: D702.3(D(IN)) J700.A6(D1+) J700.B6(D2+)
NetD708_2: D708.2(K) R712.1
NetD709_2: D709.2(K) R714.1
NetD710_2: D710.2(K) R716.1
NetFE700_2: FE700.2 J701.1
NetFE701_2: FE701.2 J701.2
NetFE702_2: FE702.2 J701.3
NetFE703_2: FE703.2 J701.4
NetFE704_2: FE704.2 J701.5
NetFE705_2: FE705.2 J701.6
NetFE706_2: FE706.2 J702.1
NetFE707_2: FE707.2 J702.2
NetFE708_2: FE708.2 J702.3
NetFE709_2: FE709.2 J703.1
NetFE710_2: FE710.2 J702.4
NetFE711_2: FE711.2 J703.2
NetFE712_2: FE712.2 J702.5
NetFE713_2: FE713.2 J703.3
NetFE714_2: FE714.2 J702.6
NetFE715_2: FE715.2 J703.4
NetFE716_2: FE716.2 J703.5
NetFE717_2: FE717.2 J703.6
NetJ700_A5: J700.A5(CC1) R701.1
NetJ700_B5: J700.B5(CC2) R702.1
NetJ704_4: J704.4(SWDIO) R710.2
NetJ704_6: J704.6(SWCLK) R711.2
NetJ704_12: J704.12(NRST) R709.2
NetJ704_13: J704.13(VCP_RX) R713.2
NetJ704_14: J704.14(VCP_TX) R715.2
NetR712_2: R712.2 T700.3(D)
NetR714_2: R714.2 T701.3(D)
NetR716_2: R716.2 T702.3(D)

Not connected (* = marked no-connect by the designer): D703 1*; D704 1*; J700 A8(SBU1)* A9(VBUS2)* A12(GND2)* B8(SBU2)* B9(VBUS4)* B12(GND)*; J704 1(N/C)* 2(N/C)* 8(SWO)* 9(N/C)* 10(N/C)*

### Layout directives
differential pair: USB_D_N, USB_D_P

### Notes on the sheet
- USB Type C Port
- (near C702) Place near to the USB Port!
- I2C Schnittstelle
- (near D702) Fullspeed Orientation:
- (near TP700) Test Punkte
- Funkmodul
- USART Schnittstelle
- (near J703) Funkmodul
- Programming Port
- Status LEDs
- Byte Overflow - DIY Electronics projects
- _byteoverflow_
- Revision
- Designer
- Datum
- AD-Version
- elektronisch signiert
- Sheet
- of

### Library data of the parts
C700-C702 = F0127: as C600 on sheet Communication; Component Type: Standard; ComponentLink1Description: Datasheet; ComponentLink1URL: http://www.murata.com/products/catalog/pdf/c02e.pdf; Status: Active; Availability Date: 15.11.2016 OPT; RoHS compliant: Yes; Flammability: n.a.; ComponentLink2Description: http://search.murata.co.jp/Ceramy/image/img/A01X/G101/ENG/GRM21BF51H105ZA12-01.pdf; ComponentLink2URL: http://search.murata.co.jp/Ceramy/image/img/A01X/G101/ENG/GRM21BF51H105ZA12-01.pdf; Pin Count: 2; Price 100: 0.067; Price 1000: 0.067; Price Date: 02.12.2019 Pro Alpha; Changed: 27.12.2012 OPT; Price: 0.118; Supplier 1: Digi-Key; Supplier Part Number 1: 490-3903-1-ND; Part Status: Discontinued at Digi-Key; RoHS: RoHS Compliant
D700 D701 D703-D707 = A0113: Diode; Part-Number: 61.1522.1215; Manufacturer: Nexperia USA Inc.; Manufacturer Part Number: PESD5V2S2UT,215; ID: A0113; Operating Range: -65°C to +150°C; Note: NXP Semiconductors PESD5V2S2UT 215 ESD Schutzdiode TVS-diode array; Value: PESD5V2S2UT 215; Specification: 22.09.2016 OPT; Component Type: Standard; ComponentLink1Description: Datasheet; ComponentLink1URL: http://www.nxp.com/documents/data_sheet/PESDXS2UT_SERIES.pdf; Status: Active; Availability Date: 22.09.2016 OPT; RoHS compliant: Yes; Flammability: n.a.; Pin Count: 3; Price 100: 0.16; Price 1000: 0.117; Changed: 22.09.2016 OPT; Price: 0.097; Price Date: 02.12.2019 Pro Alpha; Designator: PESD5V2S2UT 215; Part Status: Active; RoHS: RoHS Compliant; Supplier: Digi-Key; Supplier Part Number: 1727-3843-1-ND
D702 = A0111: Diode; Part-Number: 61.0202.2200; Manufacturer: ON Semiconductor; ID: A0111; Operating Range: -55°C to +125°C; Note: ON Semiconductor STF202-22T1G USB Filter with ESD Protection; Value: STF202-22T1G; Specification: 14.09.2016 OPT; Designator: STF202-22T1G; Component Type: Standard; ComponentLink1Description: Datasheet; ComponentLink1URL: http://www.onsemi.com/pub_link/Collateral/STF202-22T1-D.PDF; Status: Active; Availability Date: 14.09.2016 OPT; RoHS compliant: Yes; Flammability: n.a.; Pin Count: 6; Price 100: 0.303; Price 1000: 0.234; Changed: 14.09.2016 OPT; Price: 0.31; Price Date: 02.12.2019 Pro Alpha; Supplier: Digi-Key; Supplier Part Number: STF202-22T1GOSCT-ND; Manufacturer Part Number: STF202-22T1G; Part Status: Active; RoHS: RoHS Compliant
D708-D710 = A0053: as D600 on sheet Communication; Component Type: Standard; ComponentLink1Description: Datasheet; ComponentLink1URL: http://www.dialight.com/Assets/Brochures_And_Catalogs/Indication/598_SelectorGuide.pdf; Status: Active; Availability Date: 14.11.2016 OPT; RoHS compliant: Yes; Flammability: n.a.; Pin Count: 2; Price 100: 0.092; Price 1000: 0.075; Changed: 27.12.2012 OPT; Price: 0.092; Price Date: 17.09.2014 OPT; Supplier: Digi-Key; Supplier Part Number: 350-2044-1-ND; Part Status: Active; RoHS: RoHS Compliant
FE700-FE717 = M0071: Ferrite; Part-Number: 69.1810.2000; Manufacturer: Murata Electronics North America; Designator: BLM18AG102SN1D; ID: M0071; Operating Range: -55°C to +125°C; Note: Murata BLM18AG102SN1D Ferrit 1000Ohm 400mA; Specification: 21.09.2016 OPT; Value: BLM18AG102SN1D; Component Type: Standard; ComponentLink1Description: Datasheet; ComponentLink1URL: http://search.murata.co.jp/Ceramy/image/img/PDF/ENG/L0110S0100BLM18A.pdf; Status: Active; Availability Date: 21.09.2016 OPT; RoHS compliant: Yes; Flammability: n.a.; Pin Count: 2; Price 100: 0.035; Price 1000: 0.026; Price Date: 02.12.2019 Pro Alpha; Changed: 21.09.2016 OPT; Price: 0.021; Manufacturer Part Number: BLM18AG102SN1D; Part Status: Active; RoHS: RoHS Compliant; Supplier 1: Digi-Key; Supplier Part Number 1: 490-1015-1-ND
J700 = N0175: Connector; Part-Number: 00.0000.0000; Manufacturer: GCT; GateName_1: G$1; SymbolName_1: 105450-0101; MP: 1054500101; MF: Molex; ID: N0175; Operating Range: -40°C to +120°C; Designator: USB4105-GF-A; Note: USB-Stecker USB Type C,2.0, Rec, SMT,TH Shell Stakes USB4105-GF-A; Specification: 28.03.2021 PEK; Value: USB4105-GF-A; LibraryName: 105450-0101; DeviceSetName: 105450-0101; Package: None; Availability: Unavailable; Price: 0.75; Component Type: Standard; ComponentLink1Description: Datasheet; ComponentLink1URL: https://www.mouser.ch/datasheet/2/837/USB4105_spec-2327646.pdf; Status: Active; Availability Date: 28.03.2021 PEK; RoHS compliant: Yes; Flammability: UL 94 V-0; Pin Count: 16; Price 100: 0.46; Price 1000: 0.41; Price Date: 28.03.2021 PEK; Changed: 28.03.2021 PEK; Supplier 1: Mouser; Supplier Part Number 1: 640-USB4105-GF-A; Manufacturer Part Number: USB4105-GF-A; Part Status: Active; RoHS: RoHS Compliant
J701-J703 = N0117: Connector; Part-Number: 86.5180.0110-6; Designator: Stiftleiste 6pol; ID: N0117; Operating Range: -65°C to +125°C; Specification: 13.01.2015 NEC; Value: Stiftleiste 6pol; Component Type: Standard; Status: Active; Availability Date: 16.11.2016 OPT; RoHS compliant: Yes; Flammability: n.a.; Note: Stiftleiste 6pol; Pin Count: 6; Price 100: 0.05; Price 1000: 0.05; Price Date: 13.01.2015 NEC; Changed: 13.01.2015 NEC; Price: 0.05
J704 = N0177: Connector; Part-Number: 00.0000.0000; Manufacturer: Samtec; Manufacturer Part Number: FTSH-107-01-L-DV-K-A; ID: N0177; Operating Range: -40°C to +120°C; Specification: 28.03.2021 PEK; Value: Stiftleiste_Stlink_V3; Designator: Stiftleiste_Stlink_V3; Component Type: Standard; ComponentLink1Description: Datasheet; ComponentLink1URL: https://www.mouser.ch/datasheet/2/527/ftsh_smt-1316912.pdf; Status: Active; Availability Date: 28.03.2021 PEK; RoHS compliant: Yes; Flammability: UL 94 V-0; Note: Stiftleiste_Stlink_V3; Pin Count: 14; Price 100: 3.22; Price 1000: 2.20; Price Date: 28.03.2021 PEK; Changed: 28.03.2021 PEK; Price: 3.90; Supplier 1: Mouser; Supplier Part Number 1: 200-FTSH10701LDVKA; Part Status: Active; RoHS: RoHS Compliant
R700 = Q0052: Resistor; Part-Number: 71.1501.1300; Manufacturer: Vishay Dale; Manufacturer Part Number: CRCW06031K50FKEA; Designator: R 1.5k 1%; ID: Q0052; Operating Range: -55°C to +155°C; Note: 1.5k 1% 200ppm 1/10W Vishay CRCW06031K50FKTA; Changed: 19.09.2011 MLP; Verification: 05.07.2012 OPT; Value: 1.5k 1%; Component Type: Standard; ComponentLink1Description: http://www.vishay.com/docs/20035/dcrcwe3.pdf; ComponentLink1URL: http://www.vishay.com/docs/20035/dcrcwe3.pdf; Status: Active; Availability Date: 16.11.2016 OPT; RoHS compliant: Yes; Flammability: n.a.; Pin Count: 2; Price 100: 0.002; Price 1000: 0.002; Price Date: 02.12.2019 Pro Alpha; Specification: 19.09.2011 MLP; Price: 0.001; Supplier: Digi-Key; Supplier Part Number: 541-1.50KHCT-ND; Part Status: Active; RoHS: RoHS Compliant
R701 R702 = Q0166: Resistor; Part-Number: 71.5101.1300; Manufacturer: Vishay Dale; Manufacturer Part Number: CRCW06035K10FKEA; Designator: R 5.1k 1%; ID: Q0166; Note: 5.1k 1% 100ppm 1/10W Vishay CRCW06035K10FKEA; Changed: 19.09.2011 MLP; Verification: 05.07.2012 OPT; Value: 5k1 1%; Component Type: Standard; ComponentLink1Description: http://www.vishay.com/docs/20035/dcrcwe3.pdf; ComponentLink1URL: http://www.vishay.com/docs/20035/dcrcwe3.pdf; Operating Range: -; Status: Active; Availability Date: 16.11.2016 OPT; RoHS compliant: Yes; Flammability: n.a.; Pin Count: 2; Price 100: 0.002; Price 1000: 0.002; Price Date: 02.12.2019 Pro Alpha; Specification: 19.09.2011 MLP; Price: 0.002; Supplier: Digi-Key; Supplier Part Number: 541-5.10KHCT-ND; Part Status: Active; RoHS: RoHS Compliant
R703 R704 = Q0091: Resistor; Part-Number: 71.2201.1300; Manufacturer: Vishay Dale; Manufacturer Part Number: CRCW06032K20FKEA; Designator: R 2.2k 1%; ID: Q0091; Operating Range: -55°C to +155°C; Note: 2.2k 1% 100ppm 1/10W Vishay CRCW06032K20FKTA; Changed: 19.09.2011 MLP; Verification: 05.07.2012 OPT; Value: 2.2k 1%; Component Type: Standard; ComponentLink1Description: http://www.vishay.com/docs/20035/dcrcwe3.pdf; ComponentLink1URL: http://www.vishay.com/docs/20035/dcrcwe3.pdf; Status: Active; Availability Date: 16.11.2016 OPT; RoHS compliant: Yes; Flammability: n.a.; Pin Count: 2; Price 100: 0.002; Price 1000: 0.002; Price Date: 02.12.2019 Pro Alpha; Specification: 19.09.2011 MLP; Price: 0.001; Supplier: Digi-Key; Supplier Part Number: 541-2.20KHCT-ND; Part Status: Active; RoHS: RoHS Compliant
R705-R708 = Q0244: Resistor; Part-Number: 71.0000.0500; Manufacturer: Vishay Dale; Manufacturer Part Number: CRCW08050000Z0EAHP; Designator: R 0E 1%; ID: Q0244; Operating Range: -55°C to +155°C; Note: 0E 1.0% Vishay/Dale CRCW08050000Z0EA; Changed: 23.04.2013 OPT; Verification: 05.03.2013 ENP; Value: 0E 1%; Component Type: Standard; ComponentLink1Description: Datasheet; ComponentLink1URL: http://www.mouser.com/ds/2/427/dcrcwe3-109170.pdf; Status: Active; Availability Date: 16.11.2016 OPT; RoHS compliant: Yes; Flammability: n.a.; ComponentLink2Description: http://www.vishay.com/docs/20043/crcwhpe3.pdf; ComponentLink2URL: http://www.vishay.com/docs/20043/crcwhpe3.pdf; Pin Count: 2; Price 100: 0.007; Price 1000: 0.007; Price Date: 02.12.2019 Pro Alpha; Specification: 23.04.2013 OPT; Price: 0.005; Supplier: Digi-Key; Supplier Part Number: 541-0.0TBCT-ND; Part Status: Active; RoHS: RoHS Compliant
R709-R711 R713 R715 = Q0011: Resistor; Part-Number: 71.1000.1300; Manufacturer: Vishay Dale; Manufacturer Part Number: CRCW0603100RFKEA; ID: Q0011; Operating Range: -55°C to +155°C; Note: 100E 1% 100ppm 1/10W Vishay / Dale CRCW0603100RFKTB; Changed: 19.09.2011 MLP; Value: 100E 1%; Verification: 05.07.2012 OPT; Designator: R 100E 1%; Component Type: Standard; ComponentLink1Description: http://www.vishay.com/docs/20035/dcrcwe3.pdf; ComponentLink1URL: http://www.vishay.com/docs/20035/dcrcwe3.pdf; Status: Active; Availability Date: 16.11.2016 OPT; RoHS compliant: Yes; Flammability: n.a.; Pin Count: 2; Price 100: 0.002; Price 1000: 0.002; Price Date: 02.12.2019 Pro Alpha; Specification: 19.09.2011 MLP; Price: 0.002; Supplier: Digi-Key; Supplier Part Number: 541-100HCT-ND; Part Status: Active; RoHS: RoHS Compliant
R712 R714 R716 = Q0422: as R602 on sheet Communication; Component Type: Standard; ComponentLink1Description: Datasheet; ComponentLink1URL: https://www.mouser.ch/datasheet/2/315/AOA0000C304-1149620.pdf; Status: Active; Availability Date: 15.11.2019 PEK; RoHS compliant: Yes; Flammability: n.a.; Pin Count: 2; Price 100: 0.03; Price 1000: 0.011; Price Date: 15.11.2019 PEK; Specification: 15.11.2019 PEK; Price: 0.098; Supplier: Mouser; Supplier Part Number: 667-ERJ-6ENF5600V; Part Status: Active; RoHS: RoHS Compliant
R717-R719 = Q0023: Resistor; Part-Number: 71.1003.1300; Manufacturer: Vishay Dale; Manufacturer Part Number: CRCW0603100KFKEA; Designator: R 100k 1%; ID: Q0023; Operating Range: -55°C to +155°C; Note: 100k 1% 100ppm 1/10W Vishay / Dale CRCW0603100KFKEA; Changed: 19.09.2011 MLP; Verification: 05.07.2012 OPT; Value: 100k 1%; Component Type: Standard; ComponentLink1Description: http://www.vishay.com/docs/20008/dcrcw.pdf; ComponentLink1URL: http://www.vishay.com/docs/20008/dcrcw.pdf; Status: Active; Availability Date: 16.11.2016 OPT; RoHS compliant: Yes; Flammability: n.a.; ComponentLink2Description: http://www.vishay.com/docs/20035/dcrcwe3.pdf; ComponentLink2URL: http://www.vishay.com/docs/20035/dcrcwe3.pdf; Pin Count: 2; Price 100: 0.002; Price 1000: 0.002; Price Date: 02.12.2019 Pro Alpha; Specification: 19.09.2011 MLP; Price: 0.001; Supplier: Digi-Key; Supplier Part Number: 541-100KHCT-ND; Part Status: Active; RoHS: RoHS Compliant
T700-T702 = P0026: FET; Part-Number: 61.0250.0001; Manufacturer: Vishay Siliconix; Designator: SI1308EDL-T1-GE3; ID: P0026; Operating Range: -55°C to +150°C; Note: Vishay SI1308EDL-T1-GE3; Changed: 11.08.2015 OPT; Value: SI1308EDL-T1-GE3; Component Type: Standard; ComponentLink1Description: Datasheet; ComponentLink1URL: http://www.vishay.com/docs/63399/si1308edl.pdf; Status: Active; Availability Date: 15.11.2016 OPT; RoHS compliant: Yes; Flammability: n.a.; Pin Count: 3; Price 100: 0.19; Price 1000: 0.13; Price Date: 02.12.2019 Pro Alpha; Specification: 11.08.2015 OPT; Price: 0.152; Supplier Part Number 1: SI1308EDL-T1-GE3CT-ND; Manufacturer Part Number: SI1308EDL-T1-GE3; Part Status: Active; RoHS: RoHS Compliant; Supplier 1: Digi-Key
TP700 TP701 TP703-TP705 TP707 TP708 TP710 = C0020: Testpoint; Part-Number: 86.5006.0101; Manufacturer: Keystone Electronics; Manufacturer Part Number: 5006; ID: C0020; Operating Range: -40°C to +85°C; Note: Keystone Electronics 5006 Testpoint; Specification: 21.12.2012 OPT; Designator: Testpoint; Component Type: Standard; ComponentLink1Description: Datasheet; ComponentLink1URL: http://www.keyelco.com/pdfs/M60/M60p60.pdf; Status: Active; Availability Date: 14.11.2016 OPT; RoHS compliant: Yes; Flammability: n.a.; Price Date: 02.12.2019 Pro Alpha; Price 100: 0.197; Price 1000: 0.197; Pin Count: 1; Changed: 21.12.2012 OPT; Value: Testpoint; Price: 0.197; Supplier 1: Digi-Key; Supplier Part Number 1: 36-5006-ND; Part Status: Active; RoHS: RoHS Compliant